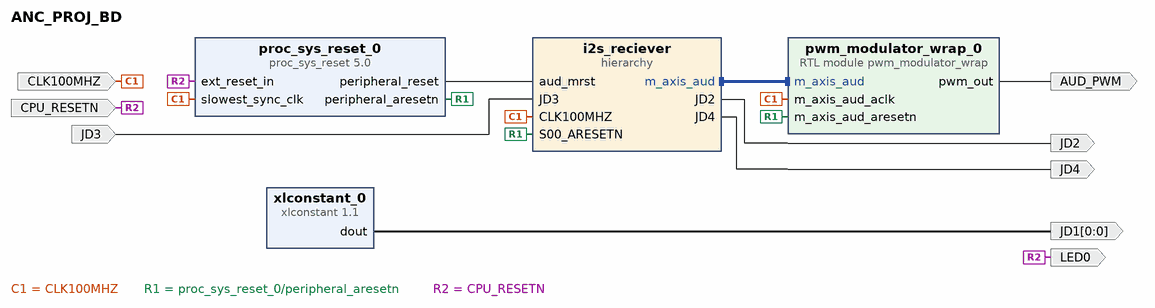
[diagram p0: block diagram of the top level]
# Vivado block design ANC_PROJ_BD, xc7a100tcsg324-1, Vivado 2021.1.1
create_bd_design ANC_PROJ_BD

create_bd_port -dir I -type clk CLK100MHZ
set_property -dict {CONFIG.CLK_DOMAIN 100MHZ_INPUT_CLK CONFIG.FREQ_HZ 100000000 CONFIG.PHASE 0.0} [get_bd_ports CLK100MHZ]
create_bd_port -dir I -type rst CPU_RESETN
set_property -dict {CONFIG.POLARITY ACTIVE_LOW} [get_bd_ports CPU_RESETN]
create_bd_port -dir O JD2
create_bd_port -dir O -type clk JD4
create_bd_port -dir I -type data JD3
create_bd_port -dir O LED0
create_bd_port -dir O AUD_PWM
create_bd_port -dir O -from 0 -to 0 JD1

create_bd_cell -type ip -vlnv xilinx.com:ip:proc_sys_reset:5.0 proc_sys_reset_0
set_property -dict {CONFIG.RESET_BOARD_INTERFACE reset CONFIG.USE_BOARD_FLOW true} [get_bd_cells proc_sys_reset_0]
create_bd_cell -type hier i2s_reciever
create_bd_cell -type ip -vlnv xilinx.com:ip:xlconstant:1.1 xlconstant_0
set_property -dict {CONFIG.CONST_VAL 0} [get_bd_cells xlconstant_0]
create_bd_cell -type module -reference pwm_modulator_wrap pwm_modulator_wrap_0

# ---- hierarchy /i2s_reciever ----
current_bd_instance /i2s_reciever
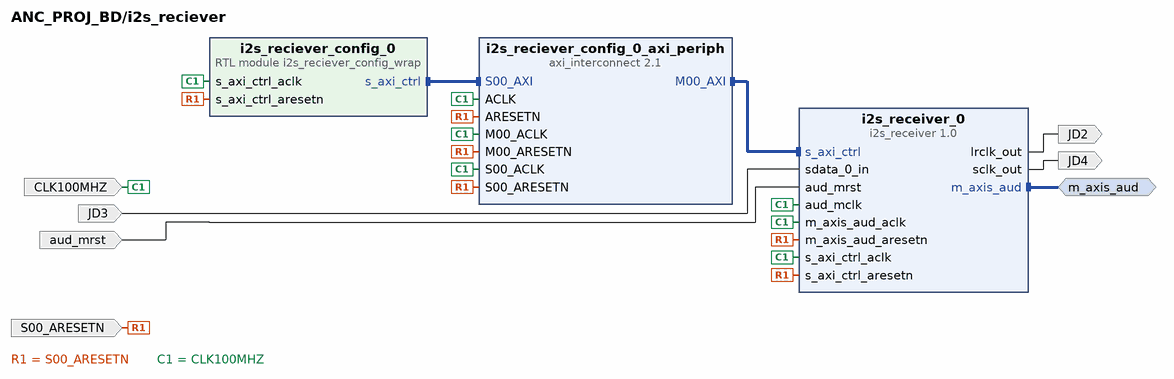
[diagram p1: block diagram inside /i2s_reciever]
create_bd_intf_pin -mode Master -vlnv xilinx.com:interface:axis_rtl:1.0 m_axis_aud
create_bd_pin -dir I -type clk CLK100MHZ
create_bd_pin -dir I -type rst S00_ARESETN
create_bd_pin -dir I -type rst aud_mrst
create_bd_pin -dir O JD2
create_bd_pin -dir O JD4
create_bd_pin -dir I JD3

create_bd_cell -type module -reference i2s_reciever_config_wrap i2s_reciever_config_0
create_bd_cell -type ip -vlnv xilinx.com:ip:i2s_receiver:1.0 i2s_receiver_0
set_property -dict {CONFIG.C_32BIT_LR 1} [get_bd_cells i2s_receiver_0]
create_bd_cell -type ip -vlnv xilinx.com:ip:axi_interconnect:2.1 i2s_reciever_config_0_axi_periph
set_property -dict {CONFIG.NUM_MI 1} [get_bd_cells i2s_reciever_config_0_axi_periph]

# ---- connections ----

current_bd_instance /i2s_reciever
connect_bd_intf_net [get_bd_intf_pins m_axis_aud] [get_bd_intf_pins i2s_receiver_0/m_axis_aud]
connect_bd_intf_net [get_bd_intf_pins i2s_reciever_config_0_axi_periph/M00_AXI] [get_bd_intf_pins i2s_receiver_0/s_axi_ctrl]
connect_bd_intf_net [get_bd_intf_pins i2s_reciever_config_0/s_axi_ctrl] [get_bd_intf_pins i2s_reciever_config_0_axi_periph/S00_AXI]
connect_bd_net -net JD3_1 [get_bd_pins JD3] [get_bd_pins i2s_receiver_0/sdata_0_in]
connect_bd_net [get_bd_pins i2s_receiver_0/lrclk_out] [get_bd_pins JD2]
connect_bd_net [get_bd_pins i2s_receiver_0/sclk_out] [get_bd_pins JD4]
connect_bd_net -net proc_sys_reset_0_peripheral_aresetn [get_bd_pins S00_ARESETN] \
  [get_bd_pins i2s_reciever_config_0_axi_periph/S00_ARESETN] [get_bd_pins i2s_receiver_0/s_axi_ctrl_aresetn] \
  [get_bd_pins i2s_reciever_config_0_axi_periph/M00_ARESETN] [get_bd_pins i2s_reciever_config_0_axi_periph/ARESETN] \
  [get_bd_pins i2s_receiver_0/m_axis_aud_aresetn] [get_bd_pins i2s_reciever_config_0/s_axi_ctrl_aresetn]
connect_bd_net -net proc_sys_reset_0_peripheral_reset [get_bd_pins aud_mrst] [get_bd_pins i2s_receiver_0/aud_mrst]
connect_bd_net -net sys_clock_1 [get_bd_pins CLK100MHZ] \
  [get_bd_pins i2s_reciever_config_0_axi_periph/ACLK] [get_bd_pins i2s_reciever_config_0_axi_periph/S00_ACLK] \
  [get_bd_pins i2s_receiver_0/s_axi_ctrl_aclk] [get_bd_pins i2s_reciever_config_0_axi_periph/M00_ACLK] \
  [get_bd_pins i2s_receiver_0/aud_mclk] [get_bd_pins i2s_receiver_0/m_axis_aud_aclk] \
  [get_bd_pins i2s_reciever_config_0/s_axi_ctrl_aclk]

current_bd_instance /
connect_bd_intf_net -intf_net i2s_receiver_0_m_axis_aud [get_bd_intf_pins i2s_reciever/m_axis_aud] [get_bd_intf_pins pwm_modulator_wrap_0/m_axis_aud]
connect_bd_net [get_bd_ports CLK100MHZ] \
  [get_bd_pins proc_sys_reset_0/slowest_sync_clk] [get_bd_pins i2s_reciever/CLK100MHZ] \
  [get_bd_pins pwm_modulator_wrap_0/m_axis_aud_aclk]
connect_bd_net -net JD3_1 [get_bd_ports JD3] [get_bd_pins i2s_reciever/JD3]
connect_bd_net [get_bd_pins i2s_reciever/JD2] [get_bd_ports JD2]
connect_bd_net [get_bd_pins i2s_reciever/JD4] [get_bd_ports JD4]
connect_bd_net [get_bd_pins proc_sys_reset_0/peripheral_aresetn] \
  [get_bd_pins i2s_reciever/S00_ARESETN] [get_bd_pins pwm_modulator_wrap_0/m_axis_aud_aresetn]
connect_bd_net [get_bd_pins proc_sys_reset_0/peripheral_reset] [get_bd_pins i2s_reciever/aud_mrst]
connect_bd_net [get_bd_pins pwm_modulator_wrap_0/pwm_out] [get_bd_ports AUD_PWM]
connect_bd_net -net reset_1 [get_bd_ports CPU_RESETN] [get_bd_pins proc_sys_reset_0/ext_reset_in] [get_bd_ports LED0]
connect_bd_net [get_bd_pins xlconstant_0/dout] [get_bd_ports JD1]

# ---- address map ----
assign_bd_address -offset 0x0000 -range 64K -target_address_space [get_bd_addr_spaces i2s_reciever/i2s_reciever_config_0/s_axi_ctrl] [get_bd_addr_segs i2s_reciever/i2s_receiver_0/s_axi_ctrl/Reg]

set_property USER_COMMENTS.comment_0 {MIC SEL = 0
Microphone active on '0'} [current_bd_design]

validate_bd_design
save_bd_design
